# Altium project Memory_Expansion_Daughter_Board.PrjPCB
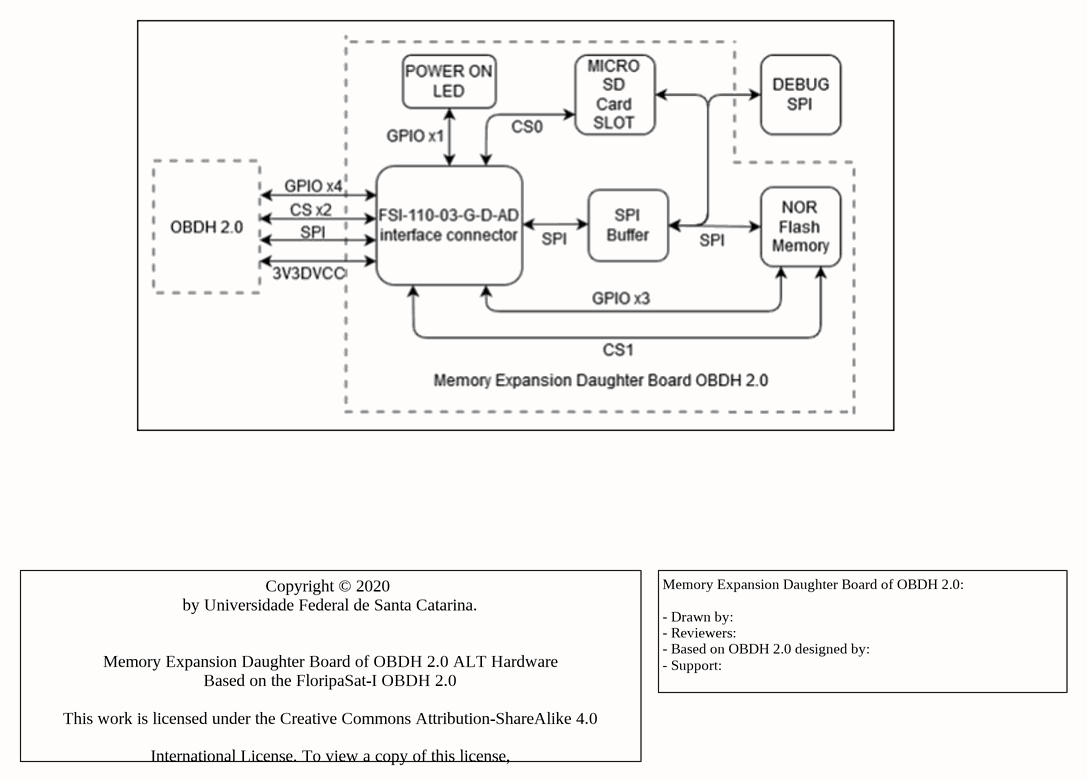
[diagram p0: 0_Architecture.SchDoc]
4 sheets, 53 parts. Net scope: hierarchical (ports join the sheet entries above them; power ports are global).
Board file: Memory_Expansion_Daughter_Board.PcbDoc
Sheets:
  0_Architecture.SchDoc
  1_Interface.SchDoc
    U_2_Non_Volatile_Memories = 2_Non_Volatile_Memories.SchDoc
    U_3_Communication_Buffers = 3_Communication_Buffers.SchDoc

## Sheet 0_Architecture.SchDoc
size A4

### Notes on the sheet
- Memory Expansion Daughter Board of OBDH 2.0:
  - Drawn by:
  - Reviewers:
  - Based on OBDH 2.0 designed by:
  - Support:
- Copyright © 2020
  by Universidade Federal de Santa Catarina.
  Memory Expansion Daughter Board of OBDH 2.0 ALT Hardware
  Based on the FloripaSat-I OBDH 2.0
  This work is licensed under the Creative Commons Attribution-ShareAlike 4.0
  International License. To view a copy of this license,
  visit http://creativecommons.org/licenses/by-sa/4.0/.

## Sheet 1_Interface.SchDoc
size A4
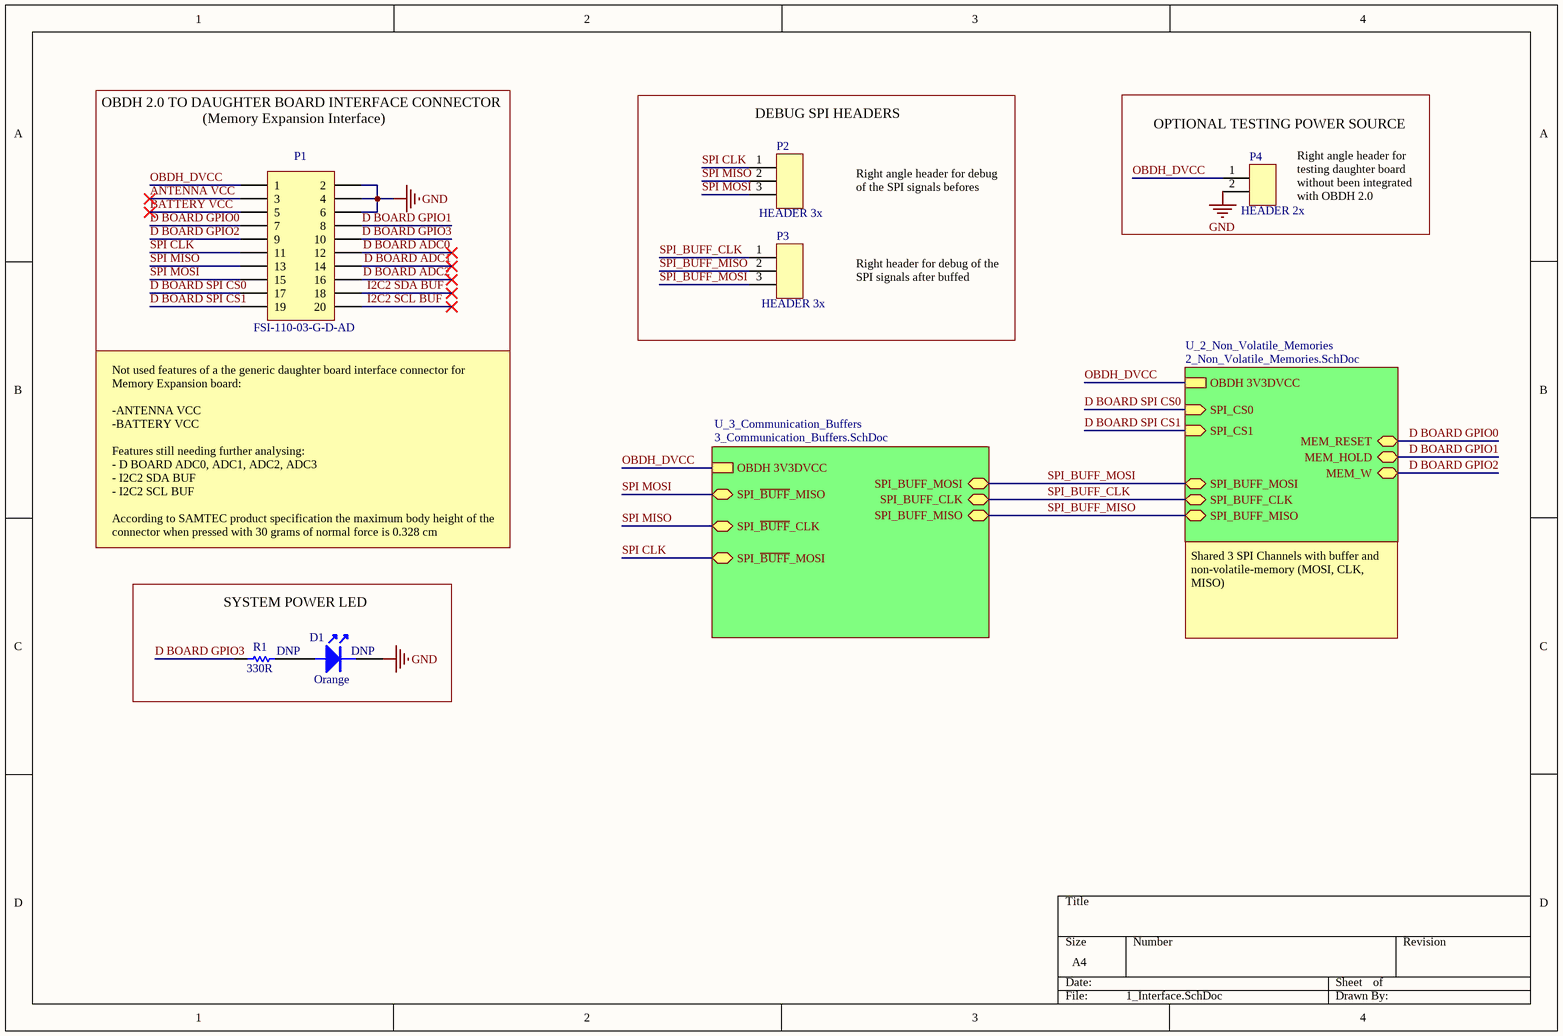
[diagram p1: 1_Interface.SchDoc]

### Parts
D1  Orange  [0805-LED]
P1  FSI-110-03-G-D-AD  [Mating FSI-110-03-G-D-AD]
P2  HEADER 3x  [Header1x3]
P3  HEADER 3x  [Header1x3]
P4  HEADER 2x  [HDR 1X2]
R1  330R  [0805]

### Blocks framed on the sheet
DEBUG SPI HEADERS: P2 P3
OPTIONAL TESTING POWER SOURCE: P4
SYSTEM POWER LED: D1 R1

### Sub-sheets
U_2_Non_Volatile_Memories = 2_Non_Volatile_Memories.SchDoc: SPI_CS1 (in), SPI_CS0 (in), MEM_RESET (bidir), MEM_HOLD (bidir), MEM_W (bidir), SPI_BUFF_MOSI (bidir), SPI_BUFF_CLK (bidir), SPI_BUFF_MISO (bidir), OBDH 3V3DVCC
U_3_Communication_Buffers = 3_Communication_Buffers.SchDoc: SPI_BUFF_MOSI (bidir), SPI_BUFF_CLK (bidir), SPI_BUFF_MISO (bidir), SPI_~{BUFF}_MISO (bidir), SPI_~{BUFF}_CLK (bidir), SPI_~{BUFF}_MOSI (bidir), OBDH 3V3DVCC

### Nets
GND: D1.2(K) P1.2 P1.4 P1.6 P4.2
OBDH_DVCC: P1.1 P4.1 ; sheet U_2_Non_Volatile_Memories/OBDH 3V3DVCC, sheet U_3_Communication_Buffers/OBDH 3V3DVCC  [project net OBDH 3V3DVCC]
ANTENNA VCC: P1.3
BATTERY VCC: P1.5
D BOARD ADC0: P1.12
D BOARD ADC1: P1.14
D BOARD ADC2: P1.16
D BOARD GPIO0: P1.7 ; sheet U_2_Non_Volatile_Memories/MEM_RESET
D BOARD GPIO1: P1.8 ; sheet U_2_Non_Volatile_Memories/MEM_HOLD
D BOARD GPIO2: P1.9 ; sheet U_2_Non_Volatile_Memories/MEM_W
D BOARD GPIO3: P1.10 R1.1
D BOARD SPI CS0: P1.17 ; sheet U_2_Non_Volatile_Memories/SPI_CS0
D BOARD SPI CS1: P1.19 ; sheet U_2_Non_Volatile_Memories/SPI_CS1
I2C2 SCL BUF: P1.20
I2C2 SDA BUF: P1.18
SPI CLK: P1.11 P2.1 ; sheet U_3_Communication_Buffers/SPI_~{BUFF}_MOSI
SPI MISO: P1.13 P2.2 ; sheet U_3_Communication_Buffers/SPI_~{BUFF}_CLK
SPI MOSI: P1.15 P2.3 ; sheet U_3_Communication_Buffers/SPI_~{BUFF}_MISO
SPI_BUFF_CLK: P3.1 ; sheet U_2_Non_Volatile_Memories/SPI_BUFF_CLK, sheet U_3_Communication_Buffers/SPI_BUFF_CLK
SPI_BUFF_MISO: P3.2 ; sheet U_2_Non_Volatile_Memories/SPI_BUFF_MISO, sheet U_3_Communication_Buffers/SPI_BUFF_MISO
SPI_BUFF_MOSI: P3.3 ; sheet U_2_Non_Volatile_Memories/SPI_BUFF_MOSI, sheet U_3_Communication_Buffers/SPI_BUFF_MOSI
NetD1_1: D1.1(A) R1.2

### Notes on the sheet
- OBDH 2.0 TO DAUGHTER BOARD INTERFACE CONNECTOR
- (Memory Expansion Interface)
- Right angle header for debug of the SPI signals befores buffed
- (near P4) Right angle header for testing daughter board without been integrated with OBDH 2.0
- Right header for debug of the SPI signals after buffed
- Not used features of a the generic daughter board interface connector for Memory Expansion board:
  -ANTENNA VCC
  -BATTERY VCC
  Features still needing further analysing:
  - D BOARD ADC0, ADC1, ADC2, ADC3
  - I2C2 SDA BUF
  - I2C2 SCL BUF
  According to SAMTEC product specification the maximum body height of the connector when pressed with 30 grams of normal force is 0.328 cm
- (near R1) DNP
- (near D1) DNP
- Shared 3 SPI Channels with buffer and non-volatile-memory (MOSI, CLK, MISO)

### Library data of the parts
D1 = LED/R_0603: SMD Orange LED; Partnumber: LTST-C170KFKT; NCM: 8541.40.21
P2 P3 = TSW-103-08-G-S-RA: Conn Unshrouded Header HDR 3 POS 2.54mm Solder RA Thru-Hole Automotive Bulk; Manufacturer: Samtec; Number of Contacts: 3; Connector Type: Male Pin; Gender: Male; Max Current Rating: 7.6A; Max Voltage Rating (AC): 450V; Supplier 1: Digi-Key; Manufacturer Part Number: TSW-103-08-G-S-RA; Stock 1: 2118; Pricing 1: 1=0.43, 10=0.403, 25=0.3456, 50=0.2938, 100=0.2822, 250=0.25344, 500=0.24192 (USD); Contact Plating: Gold; Contact Material: Bronze; Color: Black; Housing Color: Black; Housing Material: Polyester; Min Operating Temperature: -55°C; Max Operating Temperature: 125°C; Number of Rows: 1; Termination: Solder; Packaging: Bulk; Number of Positions: 3; Package Quantity: 1; Orientation: Right Angle; Length: 7.62mm; Pitch: 2.54mm; Depth: 9.9mm; Contact Mating Length: 0.23inch; Width: 2.54mm; Radiation Hardening: No; REACH SVHC: No SVHC; Lead Free: Lead Free; ComponentLink1URL: http://www.samtec.com/ftppub/pdf/htsw_th.pdf?src-supplier=Avnet+Europe; ComponentLink1Description: http://www.samtec.com/ftppub/pdf/htsw_th.pdf?src-supplier=Avnet+Europe; ComponentLink2URL: http://www.samtec.com/ftppub/pdf/htsw_th.pdf?src-supplier=Avnet; ComponentLink2Description: http://www.samtec.com/ftppub/pdf/htsw_th.pdf?src-supplier=Avnet; ComponentLink3URL: http://suddendocs.samtec.com/prints/tsw-xxx-xx-x-x-xx-xxx-footprint.pdf?src-supplier=Digi-Key; ComponentLink3Description: http://suddendocs.samtec.com/prints/tsw-xxx-xx-x-x-xx-xxx-footprint.pdf?src-supplier=Digi-Key; Supplier Part Number 1: SAM1039-03-ND
P4 = HEADER 2x: Conn Unshrouded Header HDR 2 POS 2.54mm Solder RA Thru-Hole Automotive Bulk; Manufacturer: Samtec; Manufacturer Part Number: TSW-102-08-G-S-RA; Number of Positions: 2; Connector Type: Male Pin; Gender: Male; Max Current Rating: 7.6A; Max Voltage Rating (AC): 450V; Supplier 1: Digi-Key; Stock 1: 1298; Pricing 1: 1=0.28, 10=0.269, 25=0.2304, 50=0.1958, 100=0.1882, 250=0.16896, 500=0.16128 (USD); Contact Plating: Gold; Contact Material: Bronze; Color: Black; Housing Color: Black; Housing Material: Polyester; Min Operating Temperature: -55°C; Max Operating Temperature: 125°C; Number of Rows: 1; Termination: Solder; Packaging: Bulk; Number of Contacts: 2; Orientation: Right Angle; Package Quantity: 1; Length: 5.08mm; Pitch: 2.54mm; Width: 2.54mm; Depth: 9.9mm; Contact Mating Length: 0.23inch; Radiation Hardening: No; Lead Free: Lead Free; REACH SVHC: No SVHC; ComponentLink1URL: http://www.samtec.com/ftppub/pdf/htsw_th.pdf?src-supplier=Avnet; ComponentLink1Description: http://www.samtec.com/ftppub/pdf/htsw_th.pdf?src-supplier=Avnet; ComponentLink2URL: http://suddendocs.samtec.com/prints/tsw-xxx-xx-x-x-xx-xxx-footprint.pdf?src-supplier=Digi-Key; ComponentLink2Description: http://suddendocs.samtec.com/prints/tsw-xxx-xx-x-x-xx-xxx-footprint.pdf?src-supplier=Digi-Key; Supplier Part Number 1: SAM1039-02-ND
R1 = R330R_1%_1/4W_0805: RES 330R OHM 1/4W 1% 0805; Partnumber: RC0805FR-07330RL; NCM: 8533.21.20
P1 = FSI-110-03-G-D-AD: Value: *; Partnumber: FSI-110-03-G-D-AD

## Sheet 2_Non_Volatile_Memories.SchDoc
size A4; Organization: SpaceLab UFSC; Address1: UFSC - SpaceLab; Address2: University Campus - Trindade; Address3: Dep. of Electrical Engineering - CTC; Address4: Florianópolis, Santa Catarina, Brazil; Address5: CEP: 88040 - 900
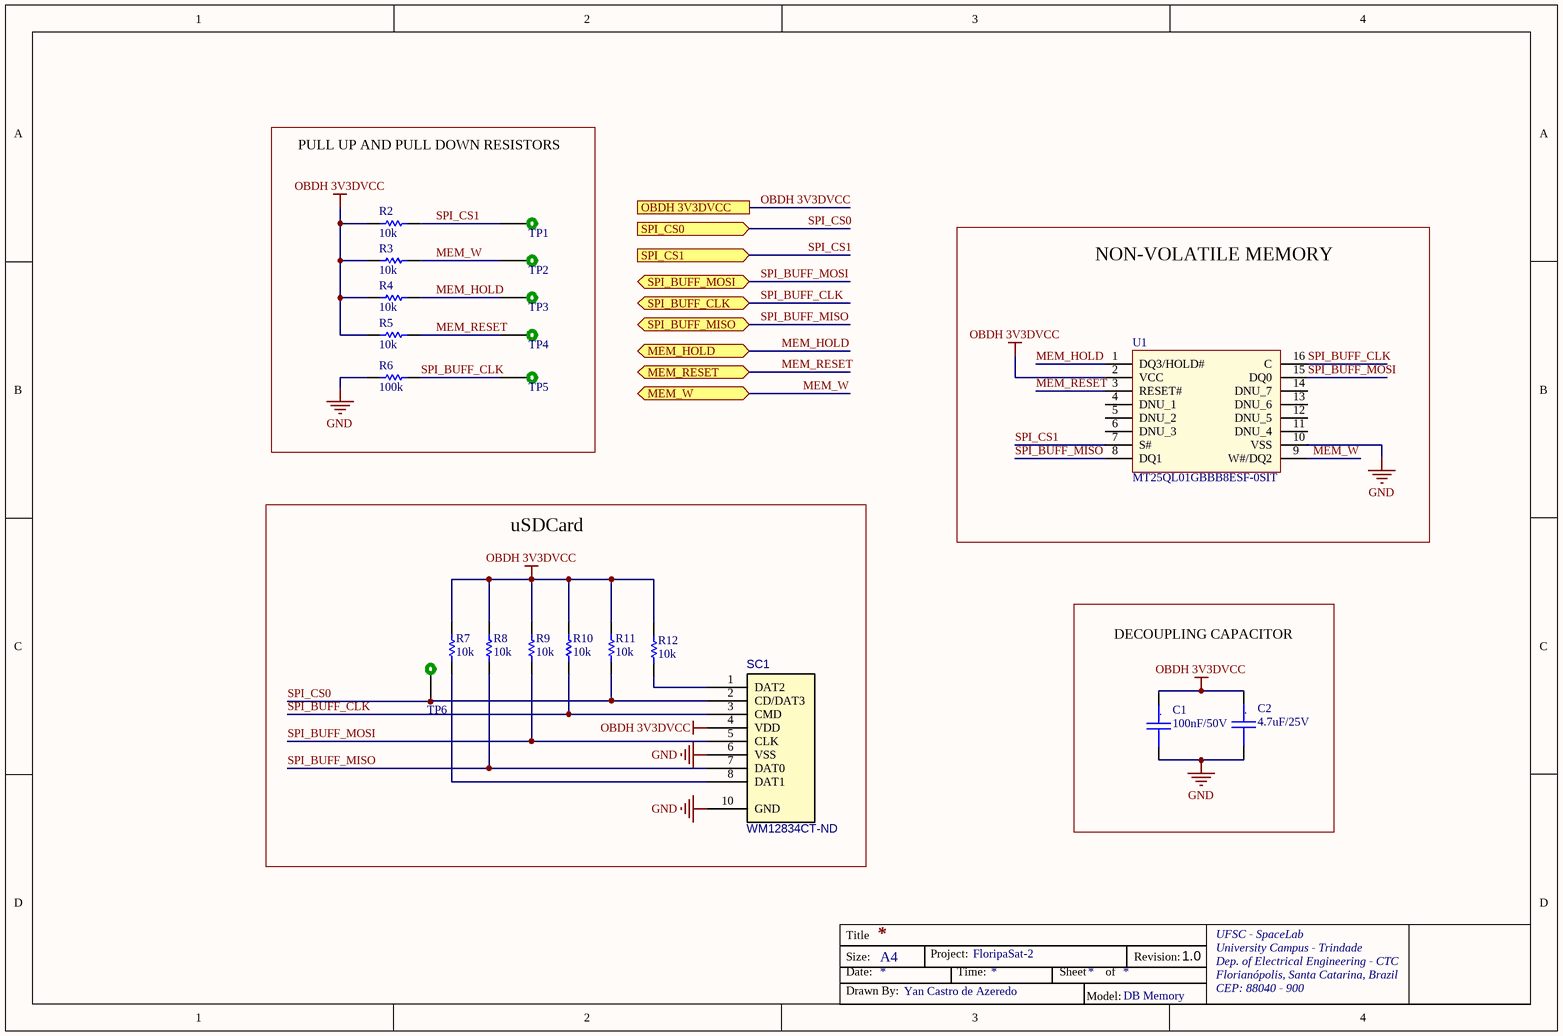
[diagram p2: 2_Non_Volatile_Memories.SchDoc]

### Parts
C1  100nF/50V  [C0603_MD]
C2  4.7uF/25V  [C0805_MD]
R2  10k  [0805]
R3  10k  [0805]
R4  10k  [0805]
R5  10k  [0805]
R6  100k  [0805]
R7  10k  [0805]
R8  10k  [0805]
R9  10k  [0805]
R10  10k  [0805]
R11  10k  [0805]
R12  10k  [0805]
SC1  WM12834CT-ND  [uSD_Card]
TP1  TEST_POINT_2  [TEST_POINT_2]  (value not drawn)  (no BOM)
TP2  TEST_POINT_2  [TEST_POINT_2]  (value not drawn)  (no BOM)
TP3  TEST_POINT_2  [TEST_POINT_2]  (value not drawn)  (no BOM)
TP4  TEST_POINT_2  [TEST_POINT_2]  (value not drawn)  (no BOM)
TP5  TEST_POINT_2  [TEST_POINT_2]  (value not drawn)  (no BOM)
TP6  TEST_POINT_2  [TEST_POINT_2]  (value not drawn)  (no BOM)
U1  MT25QL01GBBB8ESF-0SIT  [SOIC127P1032X265-16N]

### Blocks framed on the sheet
PULL UP AND PULL DOWN RESISTORS: R2-R6 TP1-TP5
NON-VOLATILE MEMORY: U1
uSDCard: R7-R12 SC1 TP6
DECOUPLING CAPACITOR: C1 C2

### Ports
MEM_HOLD (bidir), MEM_RESET (bidir), MEM_W (bidir), OBDH 3V3DVCC, SPI_BUFF_CLK (bidir), SPI_BUFF_MISO (bidir), SPI_BUFF_MOSI (bidir), SPI_CS0 (in), SPI_CS1 (in)

### Nets
GND: C1.2 C2.2 R6.2 SC1.6(VSS) SC1.10(GND) U1.10(VSS)
OBDH 3V3DVCC: C1.1 C2.1 R2.2 R3.2 R4.2 R5.2 R7.2 R8.2 R9.2 R10.2 R11.2 R12.2 SC1.4(VDD) U1.2(VCC) ; port OBDH 3V3DVCC
MEM_HOLD: R4.1 TP3.1 U1.1(DQ3/HOLD#) ; port MEM_HOLD  [project net D BOARD GPIO1]
MEM_RESET: R5.1 TP4.1 U1.3(RESET#) ; port MEM_RESET  [project net D BOARD GPIO0]
MEM_W: R3.1 TP2.1 U1.9(W#/DQ2) ; port MEM_W  [project net D BOARD GPIO2]
SPI_BUFF_CLK: R6.1 R10.1 SC1.3(CMD) TP5.1 U1.16(C) ; port SPI_BUFF_CLK
SPI_BUFF_MISO: R8.1 SC1.7(DAT0) U1.8(DQ1) ; port SPI_BUFF_MISO
SPI_BUFF_MOSI: R9.1 SC1.5(CLK) U1.15(DQ0) ; port SPI_BUFF_MOSI
SPI_CS0: R11.1 SC1.2(CD/DAT3) TP6.1 ; port SPI_CS0  [project net D BOARD SPI CS0]
SPI_CS1: R2.1 TP1.1 U1.7(S#) ; port SPI_CS1  [project net D BOARD SPI CS1]
NetR7_1: R7.1 SC1.8(DAT1)
NetR12_1: R12.1 SC1.1(DAT2)

Not connected (* = marked no-connect by the designer): U1 4(DNU_1) 5(DNU_2) 6(DNU_3) 11(DNU_4) 12(DNU_5) 13(DNU_6) 14(DNU_7)

### Notes on the sheet
- FloripaSat-2
- 1.0
- Yan Castro de Azeredo
- DB Memory
- Title
- Size:
- Date:
- A4
- Project:
- Time:
- Sheet
- of
- Revision:
- UFSC - SpaceLab
- University Campus - Trindade
- Dep. of Electrical Engineering - CTC
- Florianópolis, Santa Catarina, Brazil
- CEP: 88040 - 900
- Drawn By:
- Model:
- (in symbol Cap_Cer_X7R_4.7uF_25V_0805) .
- (in symbol Cap_Cer_X7R_100nF_50V_0603) .

### Library data of the parts
C1 = Cap_Cer_X7R_100nF_50V_0603: CAP CER 100nF 50V 0603 10%; Partnumber: C0603C104K5RAC3121; NCM: 8532.24.10
C2 = Cap_Cer_X7R_4.7uF_25V_0805: CAP CER 4.7UF 25V 10% X7R 0805; Partnumber: C0805C475K3RACAUTO; NCM: 8532.24.10
R2-R5 R7-R12 = R10k_1%_1/8W_0805: RES 10K OHM 1/8W 1%  0805; Partnumber: CRCW080510K0FKEA; NCM: 8533.21.20
R6 = R100k_1%_1/8W_0805: RES 100K OHM 1/8W 1% 0805; Partnumber: AC0805FR-13100KL; NCM: 8533.21.20
SC1 = MicroSD_Card_Connector: MicroSD CARD Connector; Partnumber: WM12834CT-ND; NCM: 8536.90.40
TP1-TP6 = TEST_POINT_2: Test point
U1 = MT25QL01GBBB8ESF-0SIT: IC FLASH 1GBIT 108MHZ 16SOIC; Manufacturer_Name: Micron; Geometry.Height: 2.65mm; Manufacturer_Part_Number: MT25QL01GBBB8ESF-0SIT; Mouser Part Number: 340-278808-TRAY; Mouser Price/Stock: https://www.mouser.com/Search/Refine.aspx?Keyword=340-278808-TRAY; RS Part Number: *; RS Price/Stock: *; Datasheet Link: https://www.micron.com/~/media/documents/products/data-sheet/nor-flash/serial-nor/mt25q/die-rev-b/mt25q_qlkt_l_01g_bbb_0.pdf

## Sheet 3_Communication_Buffers.SchDoc
size A4
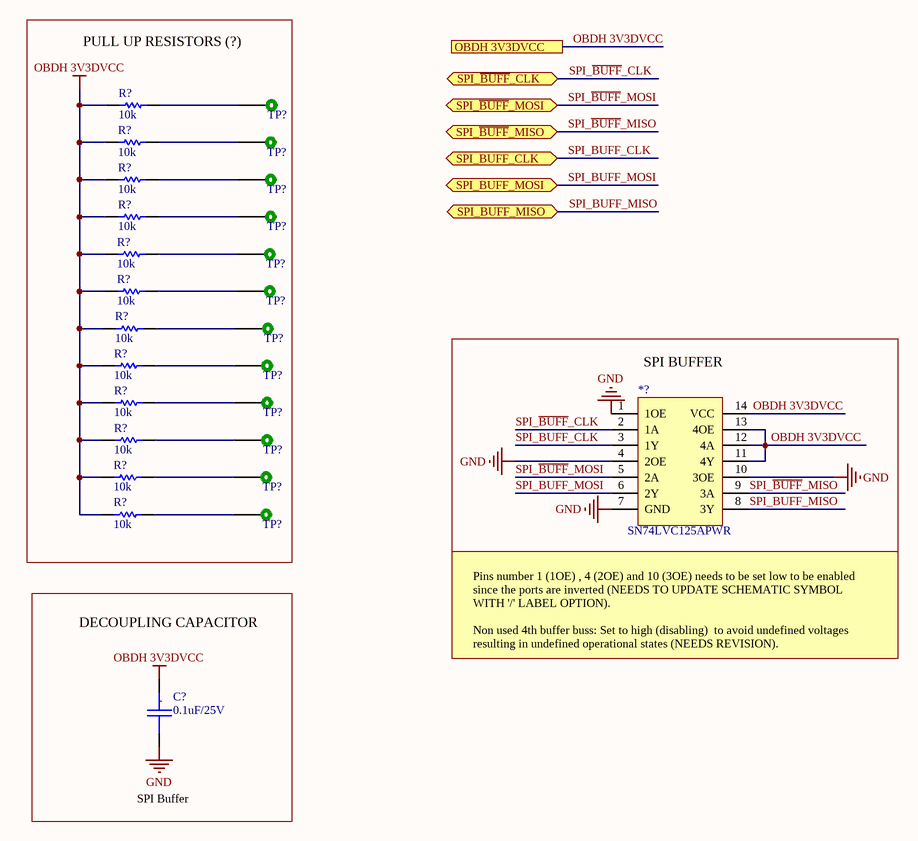
[diagram p3: 3_Communication_Buffers.SchDoc]

### Parts
(Parts that share a designator on the sheet are numbered #1, #2 ... from top to bottom, then left to right.)
*?  SN74LVC125APWR  [SN74LVC125APWR]
C?  0.1uF/25V  [CC0805]
R?#1  10k  [0805]
R?#2  10k  [0805]
R?#3  10k  [0805]
R?#4  10k  [0805]
R?#5  10k  [0805]
R?#6  10k  [0805]
R?#7  10k  [0805]
R?#8  10k  [0805]
R?#9  10k  [0805]
R?#10  10k  [0805]
R?#11  10k  [0805]
R?#12  10k  [0805]
TP?#1  TEST_POINT_2  [TEST_POINT_2]  (value not drawn)  (no BOM)
TP?#2  TEST_POINT_2  [TEST_POINT_2]  (value not drawn)  (no BOM)
TP?#3  TEST_POINT_2  [TEST_POINT_2]  (value not drawn)  (no BOM)
TP?#4  TEST_POINT_2  [TEST_POINT_2]  (value not drawn)  (no BOM)
TP?#5  TEST_POINT_2  [TEST_POINT_2]  (value not drawn)  (no BOM)
TP?#6  TEST_POINT_2  [TEST_POINT_2]  (value not drawn)  (no BOM)
TP?#7  TEST_POINT_2  [TEST_POINT_2]  (value not drawn)  (no BOM)
TP?#8  TEST_POINT_2  [TEST_POINT_2]  (value not drawn)  (no BOM)
TP?#9  TEST_POINT_2  [TEST_POINT_2]  (value not drawn)  (no BOM)
TP?#10  TEST_POINT_2  [TEST_POINT_2]  (value not drawn)  (no BOM)
TP?#11  TEST_POINT_2  [TEST_POINT_2]  (value not drawn)  (no BOM)
TP?#12  TEST_POINT_2  [TEST_POINT_2]  (value not drawn)  (no BOM)

### Blocks framed on the sheet
PULL UP RESISTORS (?): R?#1-R?#12 TP?#1-TP?#12
SPI BUFFER: *?
DECOUPLING CAPACITOR: C?

### Ports
OBDH 3V3DVCC, SPI_BUFF_CLK (bidir), SPI_BUFF_MISO (bidir), SPI_BUFF_MOSI (bidir), SPI_~{BUFF}_CLK (bidir), SPI_~{BUFF}_MISO (bidir), SPI_~{BUFF}_MOSI (bidir)

### Nets
GND: *?.1(1OE) *?.4(2OE) *?.7(GND) *?.10(3OE) C?.2
OBDH 3V3DVCC: *?.11(4Y) *?.12(4A) *?.13(4OE) *?.14(VCC) C?.1 R?#1.2 R?#2.2 R?#3.2 R?#4.2 R?#5.2 R?#6.2 R?#7.2 R?#8.2 R?#9.2 R?#10.2 R?#11.2 R?#12.2 ; port OBDH 3V3DVCC
SPI_~{BUFF}_CLK: *?.2(1A) ; port SPI_~{BUFF}_CLK  [project net SPI MISO]
SPI_~{BUFF}_MISO: *?.9(3A) ; port SPI_~{BUFF}_MISO  [project net SPI MOSI]
SPI_~{BUFF}_MOSI: *?.5(2A) ; port SPI_~{BUFF}_MOSI  [project net SPI CLK]
SPI_BUFF_CLK: *?.3(1Y) ; port SPI_BUFF_CLK
SPI_BUFF_MISO: *?.8(3Y) ; port SPI_BUFF_MISO
SPI_BUFF_MOSI: *?.6(2Y) ; port SPI_BUFF_MOSI
NetR?#1_1: R?#1.1 TP?#1.1
NetR?#2_1: R?#2.1 TP?#2.1
NetR?#3_1: R?#3.1 TP?#3.1
NetR?#4_1: R?#4.1 TP?#4.1
NetR?#5_1: R?#5.1 TP?#5.1
NetR?#6_1: R?#6.1 TP?#6.1
NetR?#7_1: R?#7.1 TP?#7.1
NetR?#8_1: R?#8.1 TP?#8.1
NetR?#9_1: R?#9.1 TP?#9.1
NetR?#10_1: R?#10.1 TP?#10.1
NetR?#11_1: R?#11.1 TP?#11.1
NetR?#12_1: R?#12.1 TP?#12.1

### Notes on the sheet
- Pins number 1 (1OE) , 4 (2OE) and 10 (3OE) needs to be set low to be enabled since the ports are inverted (NEEDS TO UPDATE SCHEMATIC SYMBOL WITH '/' LABEL OPTION).
  Non used 4th buffer buss: Set to high (disabling)  to avoid undefined voltages resulting in undefined operational states (NEEDS REVISION).
- SPI Buffer
- (in symbol Cap_Cer_X7R_0.1uF_25V_0805) .

### Library data of the parts
*? = SN74LVC125APWR: IC BUF NON-INVERT 3.6V 14TSSOP; Manufacturer: Texas Instruments; Number of Inputs: 4; Min Supply Voltage: 1.65V; Logic Function: Buffer,Inverting; Max Power Dissipation: 500mW; Propagation Delay: 4.6ns; Number of Bits per Element: 1; High Level Output Current: -24mA; Low Level Output Current: 24mA; Number of Output Lines: 3; Polarity: Non-Inverting; Turn-On Delay Time: 5.3ns; Quiescent Current: 1uA; Supplier 1: Digi-Key; Manufacturer Part Number: SN74LVC125APWR; Stock 1: 45045; Pricing 1: 1=0.47, 10=0.352, 25=0.3172, 100=0.2192, 250=0.18456, 500=0.14996, 1000=0.11536 (USD); Mount: Surface Mount; Case/Package: TSSOP; Number of Pins: 14; Contact Plating: Gold; Min Operating Temperature: -40°C; Max Operating Temperature: 125°C; Package Quantity: 1; Number of Elements: 4; Packaging: Tape and Reel; Max Supply Voltage: 3.6V; Number of Channels: 4; Number of Outputs: 4; Number of Input Lines: 4; Number of Bits: 4; Termination: SMD/SMT; Number of Circuits: 4; Number of Gates: 4; Length: 5mm; Height: 1.15mm; Width: 4.4mm; Radiation Hardening: No; REACH SVHC: No SVHC; Lead Free: Lead Free; ComponentLink1URL: http://www.ti.com/lit/ds/symlink/sn74lvc125a.pdf?src-supplier=Digi-Key; ComponentLink1Description: http://www.ti.com/lit/ds/symlink/sn74lvc125a.pdf?src-supplier=Digi-Key; ComponentLink2URL: http://www.ti.com/general/docs/lit/getliterature.tsp?genericPartNumber=SN74LVC125A&&fileType=pdf&src-supplier=Avnet; ComponentLink2Description: http://www.ti.com/general/docs/lit/getliterature.tsp?genericPartNumber=SN74LVC125A&&fileType=pdf&src-supplier=Avnet; ComponentLink3URL: http://www.farnell.com/datasheets/1764352.pdf?src-supplier=Element14; ComponentLink3Description: http://www.farnell.com/datasheets/1764352.pdf?src-supplier=Element14; ComponentLink4URL: http://www.produktinfo.conrad.com/datenblaetter/1000000-1099999/001017107-da-01-en-IC_BUS_BUF_Q_SN74LVC125APWR_TSSOP_14_TID.pdf?src-supplier=Conrad; ComponentLink4Description: http://www.produktinfo.conrad.com/datenblaetter/1000000-1099999/001017107-da-01-en-IC_BUS_BUF_Q_SN74LVC125APWR_TSSOP_14_TID.pdf?src-supplier=Conrad; Supplier Part Number 1: 296-1222-1-ND
C? = Cap_Cer_X7R_0.1uF_25V_0805: CAP CER 0.1UF 25V 10% X7R 0805; Partnumber: CC0805KRX7R8BB104; NCM: 8532.24.10
R?#1-R?#12 = R10k_1%_1/8W_0805: as R2 on sheet 2_Non_Volatile_Memories; NCM: 8533.21.20
TP?#1-TP?#12 = TEST_POINT_2: Test point

## Nets that join several sheets
GND: 1_Interface (5 pins), 2_Non_Volatile_Memories (6 pins), 3_Communication_Buffers (5 pins)
OBDH 3V3DVCC: 1_Interface (P1.1 P4.1), 2_Non_Volatile_Memories (14 pins), 3_Communication_Buffers (17 pins)
D BOARD GPIO0: 1_Interface (P1.7), 2_Non_Volatile_Memories (R5.1 TP4.1 U1.3)
D BOARD GPIO1: 1_Interface (P1.8), 2_Non_Volatile_Memories (R4.1 TP3.1 U1.1)
D BOARD GPIO2: 1_Interface (P1.9), 2_Non_Volatile_Memories (R3.1 TP2.1 U1.9)
D BOARD SPI CS0: 1_Interface (P1.17), 2_Non_Volatile_Memories (R11.1 SC1.2 TP6.1)
D BOARD SPI CS1: 1_Interface (P1.19), 2_Non_Volatile_Memories (R2.1 TP1.1 U1.7)
SPI CLK: 1_Interface (P1.11 P2.1), 3_Communication_Buffers (*?.5)
SPI MISO: 1_Interface (P1.13 P2.2), 3_Communication_Buffers (*?.2)
SPI MOSI: 1_Interface (P1.15 P2.3), 3_Communication_Buffers (*?.9)
SPI_BUFF_CLK: 1_Interface (P3.1), 2_Non_Volatile_Memories (5 pins), 3_Communication_Buffers (*?.3)
SPI_BUFF_MISO: 1_Interface (P3.2), 2_Non_Volatile_Memories (R8.1 SC1.7 U1.8), 3_Communication_Buffers (*?.8)
SPI_BUFF_MOSI: 1_Interface (P3.3), 2_Non_Volatile_Memories (R9.1 SC1.5 U1.15), 3_Communication_Buffers (*?.6)